# Altium project BG0250TG.PrjPcb
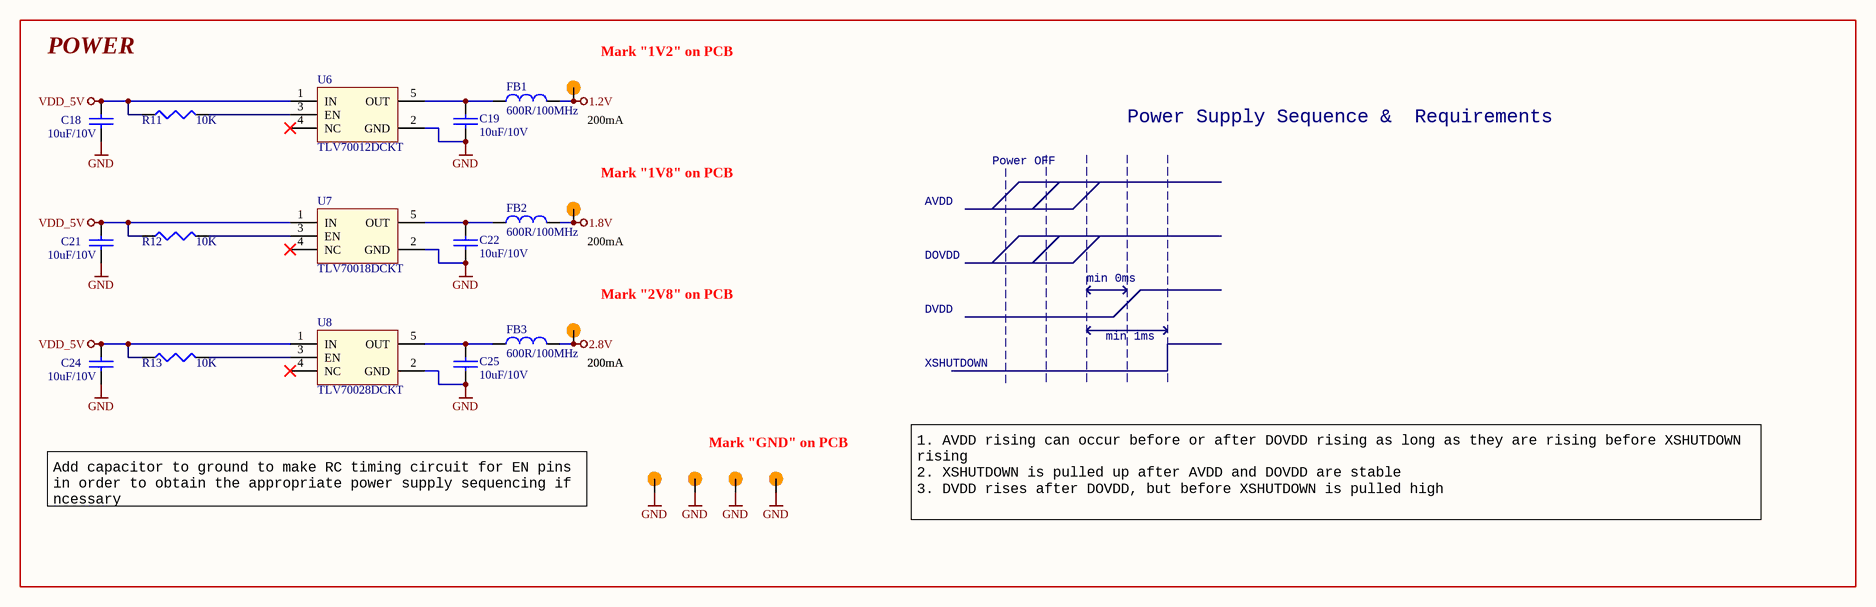
[diagram p0: Power.SchDoc]
document_number: D0000999; drawn_by: Brandon Gilles; project_title: BG0250TG; revision: R0M0E0
2 sheets, 49 parts. Net scope: global (net labels, ports and power ports of the same name join across sheets).
Board file: BG0250TG.PcbDoc
Sheets:
  Power.SchDoc
  BG0250TG_BW235_OV_9282.SchDoc

## Sheet Power.SchDoc: =project_title
size Tabloid; PageSetup: Record=PageOptions|CenterHorizontal=True|CenterVertical=True|PrintScale=0.73|XCorrection=1.00|YCorrection=1.00|PrintKind=0|BorderSize=5000000|LeftOffset=0|BottomOffset=0|Orientation=2|PaperLength=1000|PaperWidth=1000|Scale=100|PaperSource=7|PrintQuality=-4|MediaType=1|DitherType=10|PaperKind=A4|PrintScaleMode=1; CompanyName: Luxonis Holding; DrawnBy: Brandon Gilles; Organization: Luxonis Holding; Address1: 1925 Harmony Park Drive; Address2: Westminster, CO; Address3: 80234; Address4: United States; DocumentNumber: D0000999; Revision: R0M0E0; SheetNumber: 1; SheetTotal: 2

### Parts
C18  10uF/10V  [0603]
C19  10uF/10V  [0603]
C21  10uF/10V  [0603]
C22  10uF/10V  [0603]
C24  10uF/10V  [0603]
C25  10uF/10V  [0603]
FB1  600R/100MHz  [0805]
FB2  600R/100MHz  [0805]
FB3  600R/100MHz  [0805]
R11  10K  [0603]
R12  10K  [0603]
R13  10K  [0603]
TP7  TP_SMD  [TP_0.75MM_SMD_NO-SILK]  (value not drawn)  (no BOM)
TP8  TP_SMD  [TP_0.75MM_SMD_NO-SILK]  (value not drawn)  (no BOM)
TP9  TP_SMD  [TP_0.75MM_SMD_NO-SILK]  (value not drawn)  (no BOM)
TP10  TP_SMD  [TP_0.75MM_SMD_NO-SILK]  (value not drawn)  (no BOM)
TP11  TP_SMD  [TP_0.75MM_SMD_NO-SILK]  (value not drawn)  (no BOM)
TP12  TP_SMD  [TP_0.75MM_SMD_NO-SILK]  (value not drawn)  (no BOM)
TP13  TP_SMD  [TP_0.75MM_SMD_NO-SILK]  (value not drawn)  (no BOM)
U6  TLV70012DCKT  [SC70-5]
U7  TLV70018DCKT  [SC70-5]
U8  TLV70028DCKT  [SC70-5]

### Nets
1.2V: FB1.2 TP7.1
1.8V: FB2.2 TP8.1
2.8V: FB3.2 TP9.1
GND: C18.2 C19.2 C21.2 C22.2 C24.2 C25.2 TP10.1 TP11.1 TP12.1 TP13.1 U6.2(GND) U7.2(GND) U8.2(GND)
VDD_5V: C18.1 C21.1 C24.1 R11.1 R12.1 R13.1 U6.1(IN) U7.1(IN) U8.1(IN)
NetC19_1: C19.1 FB1.1 U6.5(OUT)
NetC22_1: C22.1 FB2.1 U7.5(OUT)
NetC25_1: C25.1 FB3.1 U8.5(OUT)
NetR11_2: R11.2 U6.3(EN)
NetR12_2: R12.2 U7.3(EN)
NetR13_2: R13.2 U8.3(EN)

Not connected (* = marked no-connect by the designer): U6 4(NC)*; U7 4(NC)*; U8 4(NC)*

### Notes on the sheet
- POWER
- (near TP7) Mark "1V2" on PCB
- 200mA
- (near TP8) Mark "1V8" on PCB
- Power OFF
- Power Supply Sequence &  Requirements
- AVDD
- (near TP9) Mark "2V8" on PCB
- DOVDD
- DVDD
- min 0ms
- XSHUTDOWN
- min 1ms
- Mark "GND" on PCB
- Add capacitor to ground to make RC timing circuit for EN pins in order to obtain the appropriate power supply sequencing if ncessary
- 1. AVDD rising can occur before or after DOVDD rising as long as they are rising before XSHUTDOWN rising
  2. XSHUTDOWN is pulled up after AVDD and DOVDD are stable
  3. DVDD rises after DOVDD, but before XSHUTDOWN is pulled high
- Title
- Size:
- Date:
- Tabloid
- Number:
- Time:
- Revision:
- Sheet
- of
- Drawn by:

### Library data of the parts
C18 C19 C21 C22 C24 C25 = CAP: CC0603MRX5R5BB106  SMD Multilayer Ceramic Capacitor, 0603 [1608 Metric], 10 µF, 6.3 V, ± 20%, X5R; MAN: Yageo(PHYCOM); ICCO PN: MV122009; DIST: Farnell; DIST PN: 1458902; MAN PN: CC0603MRX5R5BB106
FB1-FB3 = INDUCTANCE1: Ferrite Bead; MAN: FAIR-RITE; MAN PN: 2508056017Y2; ICCO PN: MV142024; DIST: Farnell; DIST PN: 1838838RL
R11-R13 = RES1: SMD Chip Resistor, 10 kohm, 75 V, 0603 [1608 Metric], 100 mW, ± 1%; MAN: Walsin; MAN PN: WR06X1002FTL; ICCO PN: MV122008; DIST: Farnell; DIST PN: 2502397
TP7-TP13 = TP_SMD: circular pad test point, SMD
U6 = TLV70012DCKT: LDO, 200MA, 1.2V, 5SC70; MAN: TI; DIST PN: 2437498; DIST: Farnell; ICCO PN: MV250001; MAN PN: TLV70012DCKT
U7 = TLV70018DCKT: LDO, 200MA, 1.8V, 5SC70; MAN: TI; DIST PN: 1778221; DIST: Farnell; ICCO PN: MV198003; MAN PN: TLV70018DCKT
U8 = TLV70028DCKT: LDO, 200MA, 2.8V, 5SC70; MAN: TI; DIST PN: 1778222; DIST: Farnell; ICCO PN: MV250002; MAN PN: TLV70028DCKT

## Sheet BG0250TG_BW235_OV_9282.SchDoc: =project_title
size Tabloid; PageSetup: Record=PageOptions|CenterHorizontal=True|CenterVertical=True|PrintScale=0.71|XCorrection=1.00|YCorrection=1.00|PrintKind=0|BorderSize=5000000|LeftOffset=0|BottomOffset=0|Orientation=2|PaperLength=1000|PaperWidth=1000|Scale=100|PaperSource=7|PrintQuality=-4|MediaType=1|DitherType=10|PrintScaleMode=1|PaperKind=A4; CompanyName: Luxonis Holding; DrawnBy: Brandon Gilles; Organization: Luxonis Holding; Address1: 1925 Harmony Park Drive; Address2: Westminster, CO; Address3: 80234; Address4: United States; DocumentNumber: D0000999; Revision: R0M0E0; SheetNumber: 2; SheetTotal: 2
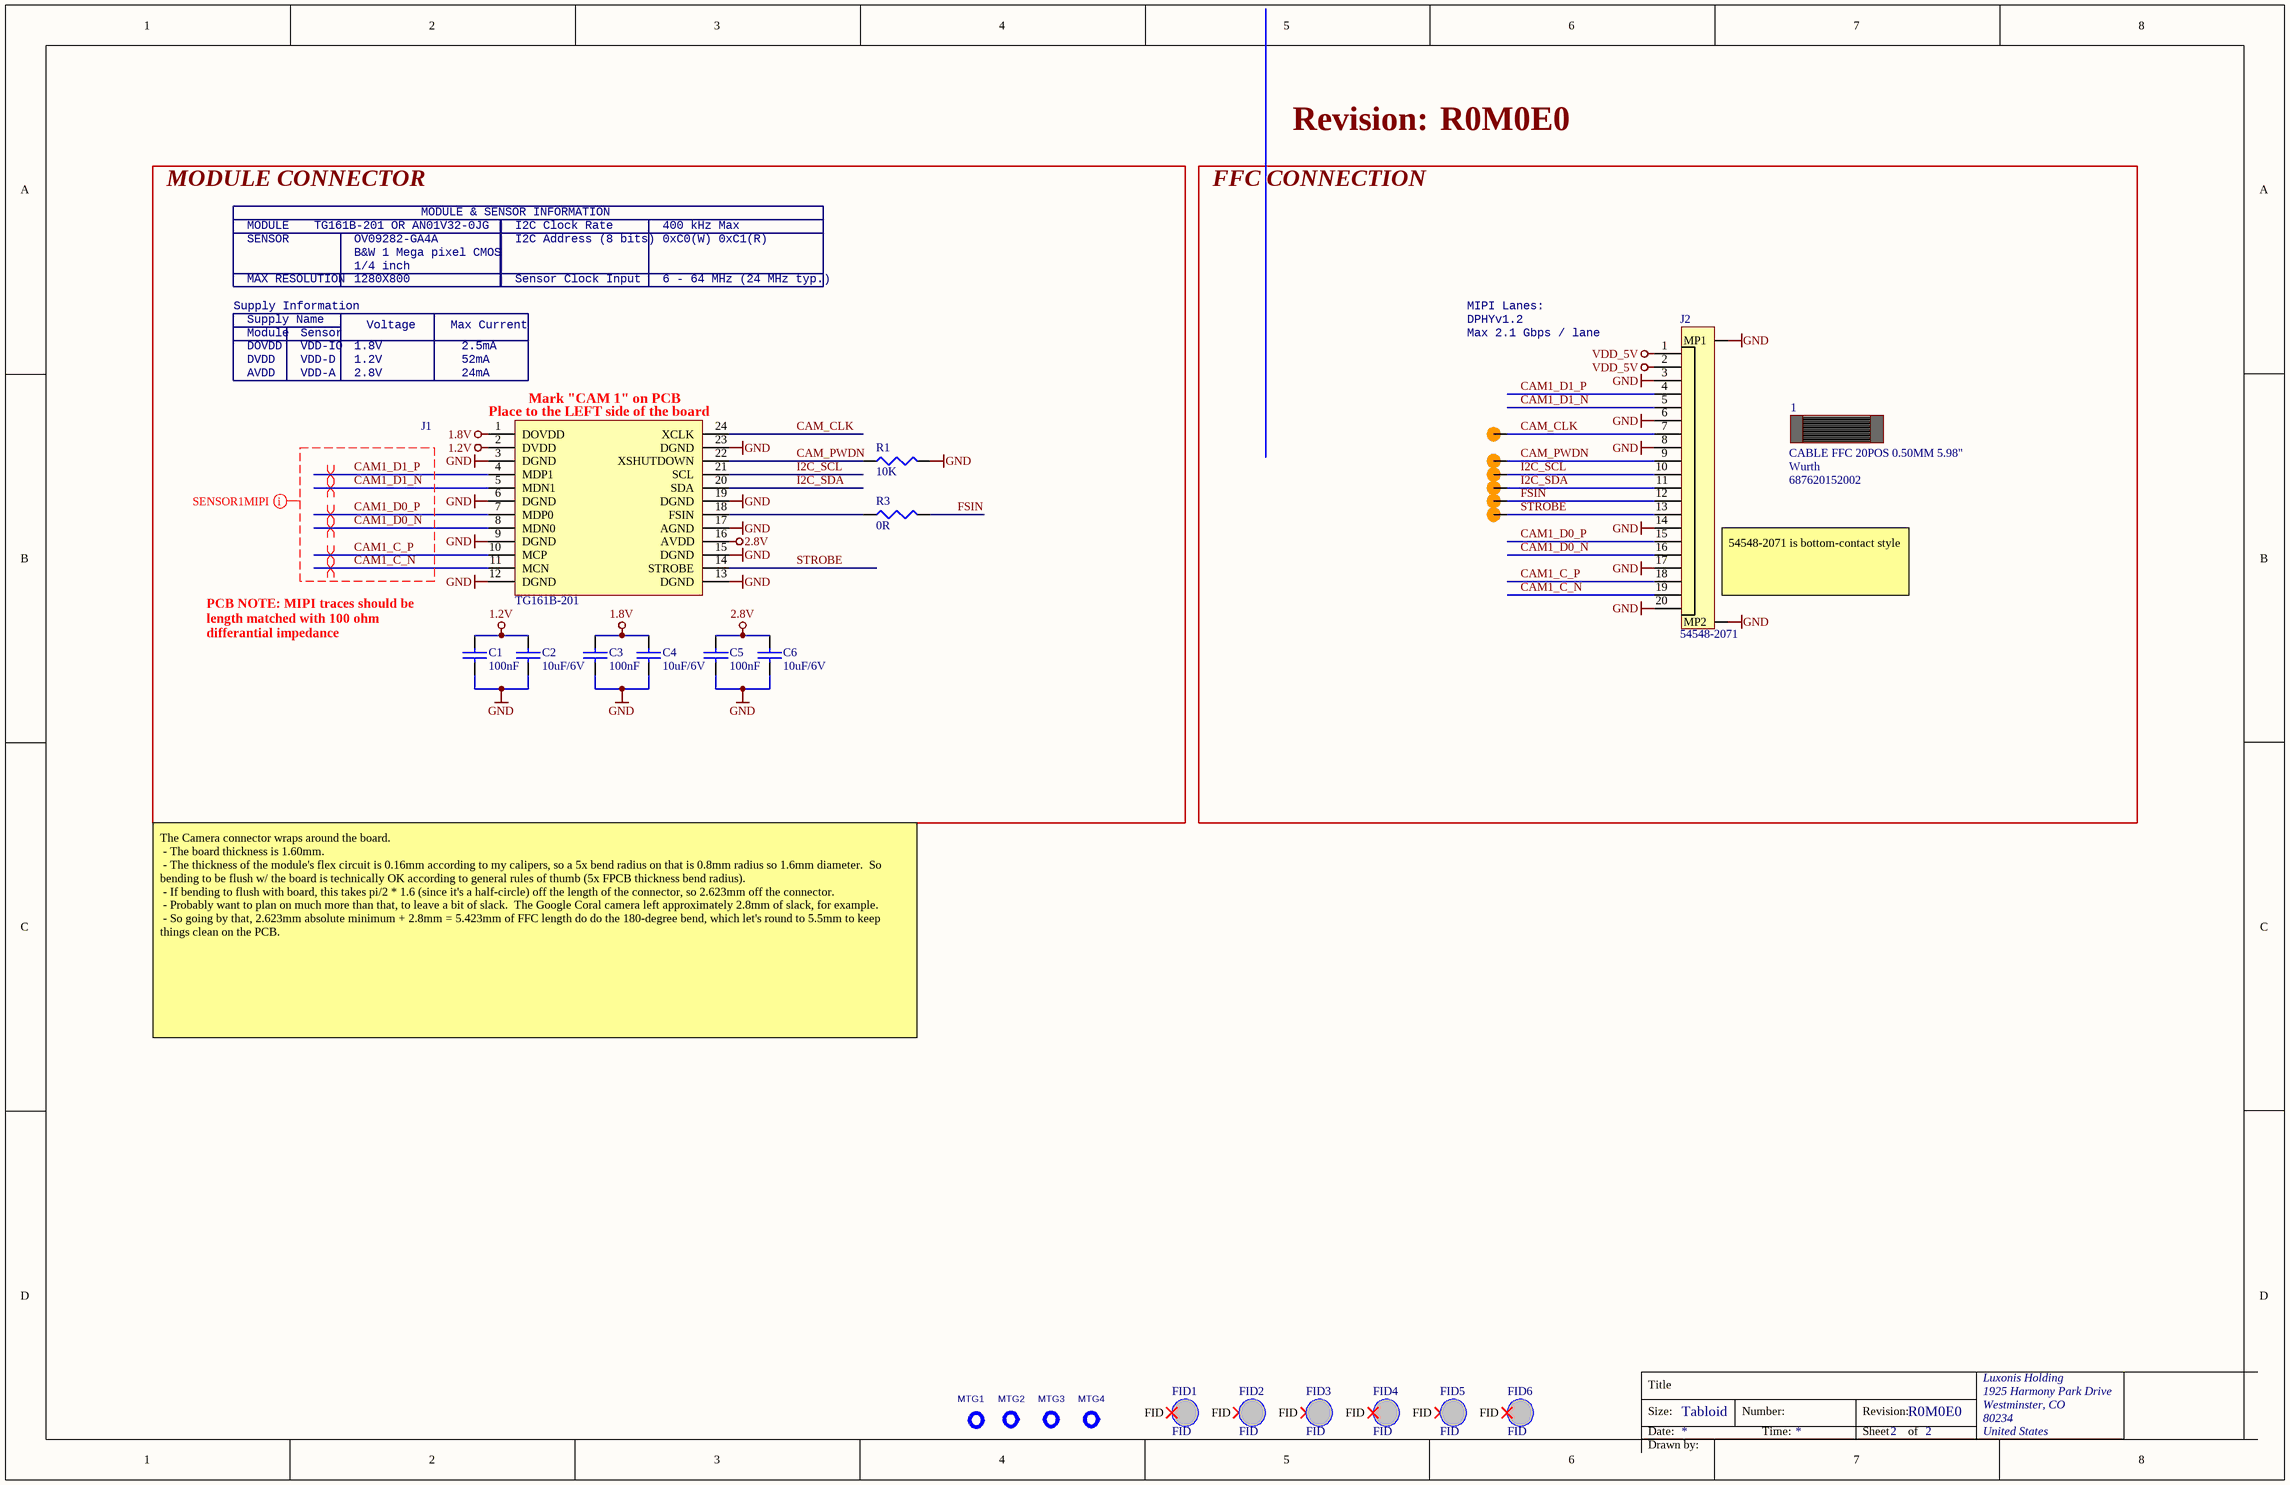
[diagram p1: BG0250TG_BW235_OV_9282.SchDoc]

### Parts
1  687620152002  ICCO PN: CABLE FFC 20POS 0.50MM 5.98"  MAN: Wurth  (mechanical)
C1  100nF  [0402]
C2  10uF/6V  [0603]
C3  100nF  [0402]
C4  10uF/6V  [0603]
C5  100nF  [0402]
C6  10uF/6V  [0603]
FID1  FID  [FIDUCIAL_1MM]  (no BOM)
FID2  FID  [FIDUCIAL_1MM]  (no BOM)
FID3  FID  [FIDUCIAL_1MM]  (no BOM)
FID4  FID  [FIDUCIAL_1MM]  (no BOM)
FID5  FID  [FIDUCIAL_1MM]  (no BOM)
FID6  FID  [FIDUCIAL_1MM]  (no BOM)
J1  TG161B-201  [TG161B-201 / AN01V32 - Board Wrap]
J2  54548-2071  [545482071]
MTG1  MTG-HOLE  [Hole_2.2mm]  (value not drawn)  (no BOM)
MTG2  MTG-HOLE  [Hole_2.2mm]  (value not drawn)  (no BOM)
MTG3  MTG-HOLE  [Hole_2.2mm]  (value not drawn)  (no BOM)
MTG4  MTG-HOLE  [Hole_2.2mm]  (value not drawn)  (no BOM)
R1  10K  [0603]
R3  0R  [0603]
TP1  TP_SMD  [TP_0.75MM_SMD_NO-SILK]  (value not drawn)  (no BOM)
TP2  TP_SMD  [TP_0.75MM_SMD_NO-SILK]  (value not drawn)  (no BOM)
TP3  TP_SMD  [TP_0.75MM_SMD_NO-SILK]  (value not drawn)  (no BOM)
TP4  TP_SMD  [TP_0.75MM_SMD_NO-SILK]  (value not drawn)  (no BOM)
TP5  TP_SMD  [TP_0.75MM_SMD_NO-SILK]  (value not drawn)  (no BOM)
TP6  TP_SMD  [TP_0.75MM_SMD_NO-SILK]  (value not drawn)  (no BOM)

### Blocks framed on the sheet
MODULE CONNECTOR: C1-C6 J1 R1 R3
FFC CONNECTION: 1 J2 TP1-TP6

### Nets
1.2V: C1.2 C2.2 J1.2(DVDD)
1.8V: C3.2 C4.2 J1.1(DOVDD)
2.8V: C5.2 C6.2 J1.16(AVDD)
GND: C1.1 C2.1 C3.1 C4.1 C5.1 C6.1 J1.3(DGND) J1.6(DGND) J1.9(DGND) J1.12(DGND) J1.13(DGND) J1.15(DGND) J1.17(AGND) J1.19(DGND) J1.23(DGND) J2.3 J2.6 J2.8 J2.14 J2.17 J2.20 J2.MP1 J2.MP2 R1.2
VDD_5V: J2.1 J2.2
CAM1_C_N: J1.11(MCN) J2.19
CAM1_C_P: J1.10(MCP) J2.18
CAM1_D0_N: J1.8(MDN0) J2.16
CAM1_D0_P: J1.7(MDP0) J2.15
CAM1_D1_N: J1.5(MDN1) J2.5
CAM1_D1_P: J1.4(MDP1) J2.4
CAM_CLK: J1.24(XCLK) J2.7 TP1.1
CAM_PWDN: J1.22(XSHUTDOWN) J2.9 R1.1 TP2.1
FSIN: J2.12 R3.2 TP5.1
I2C_SCL: J1.21(SCL) J2.10 TP3.1
I2C_SDA: J1.20(SDA) J2.11 TP4.1
STROBE: J1.14(STROBE) J2.13 TP6.1
NetJ1_18: J1.18(FSIN) R3.1

Not connected (* = marked no-connect by the designer): FID1 FID*; FID2 FID*; FID3 FID*; FID4 FID*; FID5 FID*; FID6 FID*

### Layout directives
differential pair: CAM1_C_N, CAM1_C_P, CAM1_D0_N, CAM1_D0_P, CAM1_D1_N, CAM1_D1_P
net class SENSOR1MIPI: CAM1_C_N, CAM1_C_P, CAM1_D0_N, CAM1_D0_P, CAM1_D1_N, CAM1_D1_P

### Notes on the sheet
- Revision:
- MODULE
- TG161B-201 OR AN01V32-0JG
- MODULE & SENSOR INFORMATION
- I2C Clock Rate
- 400 kHz Max
- SENSOR
- MAX RESOLUTION
- B&W 1 Mega pixel CMOS
- 1280X800
- OV09282-GA4A
- 1/4 inch
- I2C Address (8 bits)
- Sensor Clock Input
- 6 - 64 MHz (24 MHz typ.)
- 0xC0(W) 0xC1(R)
- Supply Information
- DOVDD
- DVDD
- Supply Name
- Module
- VDD-IO
- VDD-D
- Sensor
- 1.8V
- 1.2V
- Voltage
- Max Current
- 2.5mA
- 52mA
- MIPI Lanes:
- Max 2.1 Gbps / lane
- DPHYv1.2
- AVDD
- VDD-A
- 2.8V
- 24mA
- (near J1) Place to the LEFT side of the board
- (near J1) Mark "CAM 1" on PCB
- (near J2) 54548-2071 is bottom-contact style
- (near C1) PCB NOTE: MIPI traces should be length matched with 100 ohm differantial impedance
- The Camera connector wraps around the board.
  - The board thickness is 1.60mm.
  - The thickness of the module's flex circuit is 0.16mm according to my calipers, so a 5x bend radius on that is 0.8mm radius so 1.6mm diameter.  So bending to be flush w/ the board is technically OK according to general rules of thumb (5x FPCB thickness bend radius).
  - If bending to flush with board, this takes pi/2 * 1.6 (since it's a half-circle) off the length of the connector, so 2.623mm off the connector.
  - Probably want to plan on much more than that, to leave a bit of slack.  The Google Coral camera left approximately 2.8mm of slack, for example.
  - So going by that, 2.623mm absolute minimum + 2.8mm = 5.423mm of FFC length do do the 180-degree bend, which let's round to 5.5mm to keep things clean on the PCB.
- Title
- Size:
- Date:
- Tabloid
- Number:
- Time:
- Sheet
- of
- Drawn by:

### Library data of the parts
1 = 26 pin FFC cable 15cm: 20 pin FFC cable 15cm; DIST: DigiKey; DIST PN: 732-5165-ND; MAN PN: 687620152002
C1 C3 C5 = CAP: SMD Multilayer Ceramic Capacitor, 0402 [1005 Metric], 0.1 µF, 10 V, ± 10%, X5R; MAN: Kemet; MAN PN: C0402C104K8PACTU; ICCO PN: MV122005; DIST: Farnell; DIST PN: 2392235
C2 C4 C6 = CAP: as C18 on sheet Power; MAN PN: CC0603MRX5R5BB106
FID1-FID6 = FID: Fiducial mark; MAN PN: No part on PCB; MAN: Fiducial
J1 = TG161B-201: 24 way, 2row baord to board connector SMD; ICCO PN: MV250003; MAN: ACON; MAN PN: BBR43-24KB533; DIST: Sunny; DIST PN: BBR43-24KB533
J2 = 54548-2071: FFC & FPC Connectors 0.5 FPC ZIF Hsg Assy ssy 20Ckt EmbsTp Pkg; Manufacturer_Name: Molex; Manufacturer_Part_Number: 54548-2271; Datasheet Link: http://www.molex.com/webdocs/datasheets/pdf/en-us//0545482271_FFC_FPC_CONNECTORS.pdf; Height: 1mm; Mouser Part Number: 538-54548-2271; Mouser Price/Stock: https://www.mouser.com/Search/Refine.aspx?Keyword=538-54548-2271
MTG1-MTG4 = MTG-HOLE-NO-PLATE: Mounting Hole
R1 = RES1: as R11 on sheet Power
R3 = RES1: SMD Chip Resistor, Thick Film, 0 ohm, 75 V, 0603 [1608 Metric], 100 mW; MAN: Panasonic; MAN PN: ERJ3GEY0R00V; ICCO PN: MV122003; DIST: Farnell; DIST PN: 2059527RL
TP1-TP6 = TP_SMD: circular pad test point, SMD

## Nets that join several sheets
1.2V: Power (FB1.2 TP7.1), BG0250TG_BW235_OV_9282 (C1.2 C2.2 J1.2)
1.8V: Power (FB2.2 TP8.1), BG0250TG_BW235_OV_9282 (C3.2 C4.2 J1.1)
2.8V: Power (FB3.2 TP9.1), BG0250TG_BW235_OV_9282 (C5.2 C6.2 J1.16)
GND: Power (13 pins), BG0250TG_BW235_OV_9282 (24 pins)
VDD_5V: Power (9 pins), BG0250TG_BW235_OV_9282 (J2.1 J2.2)

## Assembly variants
Production: all parts fitted